# Altium project ECE453-MCU.PrjPcb
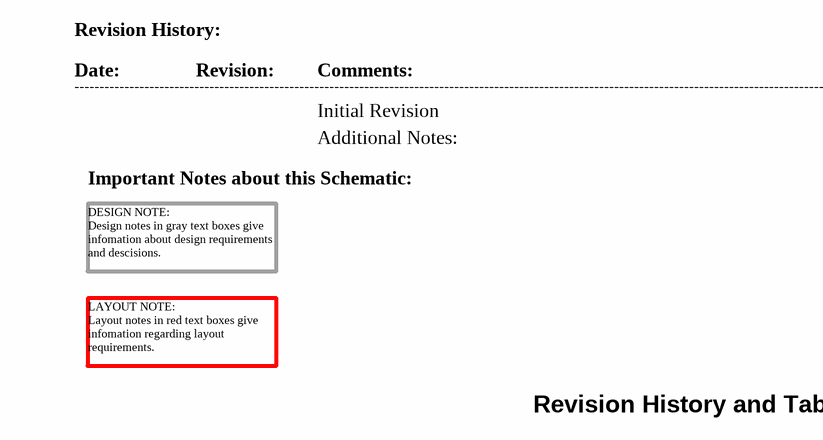
[diagram p0: 01-Revision_History_and_Contents.SchDoc]
9 sheets, 69 parts. Net scope: flat (ports and power ports of the same name join across sheets).
Board file: ECE453.PcbDoc
Sheets:
  01-Revision_History_and_Contents.SchDoc
  02-MCU.SchDoc
  03-Headers.SchDoc
  04-USB.SchDoc
  05-Power_A.SchDoc
  06-Power_B.SchDoc
  07-EEPROM.SchDoc
  Potentiometer.SchDoc
  08-Potentiometer.SchDoc

## Sheet 01-Revision_History_and_Contents.SchDoc: Revision & History
size A; Revision: A; SheetNumber: 1; SheetTotal: 4; ECE315_Project_Name: ECE453 F24 Staff Dev Board

### Notes on the sheet
- Revision History:
- Date:
- ----------------------------------------------------------------------------------------------------------------------------------------------------------------------
- Revision:
- Comments:
- Initial Revision
- Important Notes about this Schematic:
- Additional Notes:
- DESIGN NOTE:
  Design notes in gray text boxes give infomation about design requirements and descisions.
- LAYOUT NOTE:
  Layout notes in red text boxes give infomation regarding layout requirements.
- Revision History and Table of Contents
- Title:
- Size:
- A
- Project
- Rev:
- Sheet:
- of
- College of Engineering
- 1415 Engineering Drive
- Madison, WI 53706

## Sheet 02-MCU.SchDoc
size A
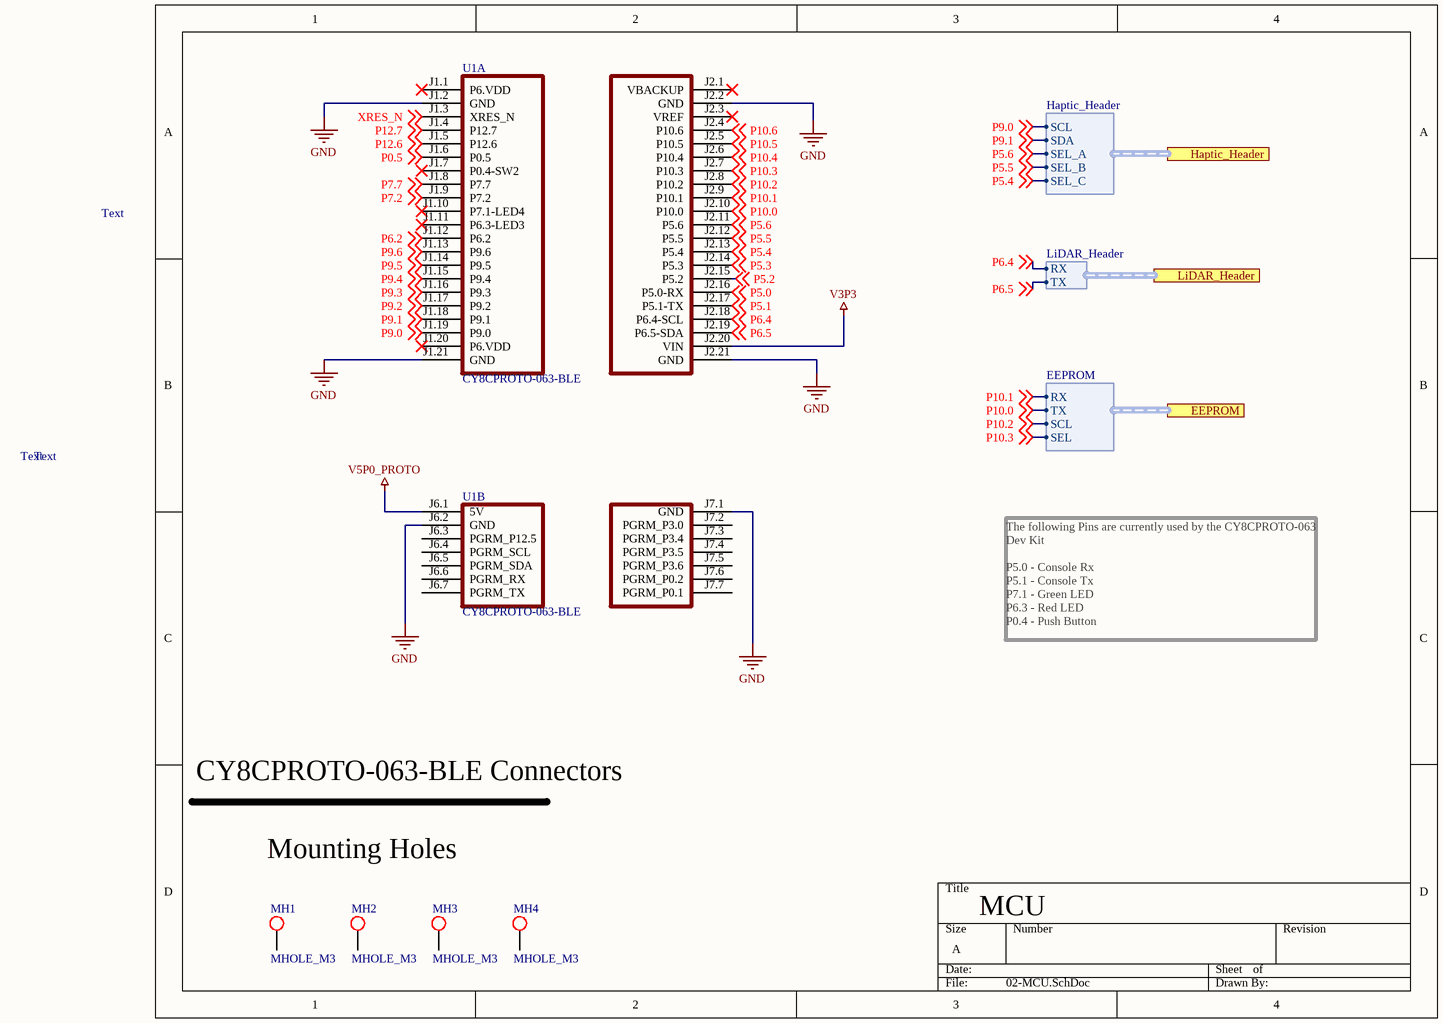
[diagram p1: 02-MCU.SchDoc]

### Parts
MH1  MHOLE_M3  [MHOLE_M3]  (no BOM)
MH2  MHOLE_M3  [MHOLE_M3]  (no BOM)
MH3  MHOLE_M3  [MHOLE_M3]  (no BOM)
MH4  MHOLE_M3  [MHOLE_M3]  (no BOM)
U1  CY8CPROTO-063-BLE  [CY8CPROTO-063-BLE]  (parts A,B of 2)  (no BOM)

### Ports
EEPROM (harness EEPROM), Haptic_Header (harness Haptic_Header), LiDAR_Header (harness LiDAR_Header)

### Harnesses
Haptic_Header: SCL, SDA, SEL_A, SEL_B, SEL_C
LiDAR_Header: RX, TX
EEPROM: RX, TX, SCL, SEL

### Nets
GND: U1.J1.2(GND) U1.J1.21(GND) U1.J2.2(GND) U1.J2.21(GND) U1.J6.2(GND) U1.J7.1(GND)
V3P3: U1.J2.20(VIN)
V5P0_PROTO: U1.J6.1(5V)
P0.5: U1.J1.6(P0.5) ; off-sheet P0.5
P5.0: U1.J2.16(P5.0-RX) ; off-sheet P5.0
P5.1: U1.J2.17(P5.1-TX) ; off-sheet P5.1
P5.2: U1.J2.15(P5.2) ; off-sheet P5.2
P5.3: U1.J2.14(P5.3) ; off-sheet P5.3
P5.4: U1.J2.13(P5.4) ; off-sheet P5.4, port Haptic_Header.SEL_C  [project net HDR_0.SEL_C]
P5.5: U1.J2.12(P5.5) ; off-sheet P5.5, port Haptic_Header.SEL_B  [project net HDR_0.SEL_B]
P5.6: U1.J2.11(P5.6) ; off-sheet P5.6, port Haptic_Header.SEL_A  [project net HDR_0.SEL_A]
P6.2: U1.J1.12(P6.2) ; off-sheet P6.2
P6.4: U1.J2.18(P6.4-SCL) ; off-sheet P6.4, port LiDAR_Header.RX  [project net HDR_1.RX]
P6.5: U1.J2.19(P6.5-SDA) ; off-sheet P6.5, port LiDAR_Header.TX  [project net HDR_1.TX]
P7.2: U1.J1.9(P7.2) ; off-sheet P7.2
P7.7: U1.J1.8(P7.7) ; off-sheet P7.7
P9.0: U1.J1.19(P9.0) ; off-sheet P9.0, port Haptic_Header.SCL  [project net HDR_0.SCL]
P9.1: U1.J1.18(P9.1) ; off-sheet P9.1, port Haptic_Header.SDA  [project net HDR_0.SDA]
P9.2: U1.J1.17(P9.2) ; off-sheet P9.2
P9.3: U1.J1.16(P9.3) ; off-sheet P9.3
P9.4: U1.J1.15(P9.4) ; off-sheet P9.4
P9.5: U1.J1.14(P9.5) ; off-sheet P9.5
P9.6: U1.J1.13(P9.6) ; off-sheet P9.6
P10.0: U1.J2.10(P10.0) ; off-sheet P10.0, port EEPROM.TX  [project net MCU.TX]
P10.1: U1.J2.9(P10.1) ; off-sheet P10.1, port EEPROM.RX  [project net MCU.RX]
P10.2: U1.J2.8(P10.2) ; off-sheet P10.2, port EEPROM.SCL  [project net MCU.SCL]
P10.3: U1.J2.7(P10.3) ; off-sheet P10.3, port EEPROM.SEL  [project net MCU.SEL]
P10.4: U1.J2.6(P10.4) ; off-sheet P10.4
P10.5: U1.J2.5(P10.5) ; off-sheet P10.5
P10.6: U1.J2.4(P10.6) ; off-sheet P10.6
P12.6: U1.J1.5(P12.6) ; off-sheet P12.6
P12.7: U1.J1.4(P12.7) ; off-sheet P12.7
XRES_N: U1.J1.3(XRES_N) ; off-sheet XRES_N

Not connected (* = marked no-connect by the designer): MH1 1; MH2 1; MH3 1; MH4 1; U1 J1.1(P6.VDD)* J1.7(P0.4-SW2)* J1.10(P7.1-LED4)* J1.11(P6.3-LED3)* J1.20(P6.VDD)* J2.1(VBACKUP)* J2.3(VREF)* J6.3(PGRM_P12.5) J6.4(PGRM_SCL) J6.5(PGRM_SDA) J6.6(PGRM_RX) J6.7(PGRM_TX) J7.2(PGRM_P3.0) J7.3(PGRM_P3.4) J7.4(PGRM_P3.5) J7.5(PGRM_P3.6) J7.6(PGRM_P0.2) J7.7(PGRM_P0.1)

### Notes on the sheet
- Text
- The following Pins are currently used by the CY8CPROTO-063 Dev Kit
  P5.0 - Console Rx
  P5.1 - Console Tx
  P7.1 - Green LED
  P6.3 - Red LED
  P0.4 - Push Button
- CY8CPROTO-063-BLE Connectors
- Mounting Holes
- MCU

### Library data of the parts
MH1-MH4 = MHOLE_M3: Mounting Hole - M3 Metric
U1 = IC_CY8CPROTO-063-BLE

## Sheet 03-Headers.SchDoc
size A
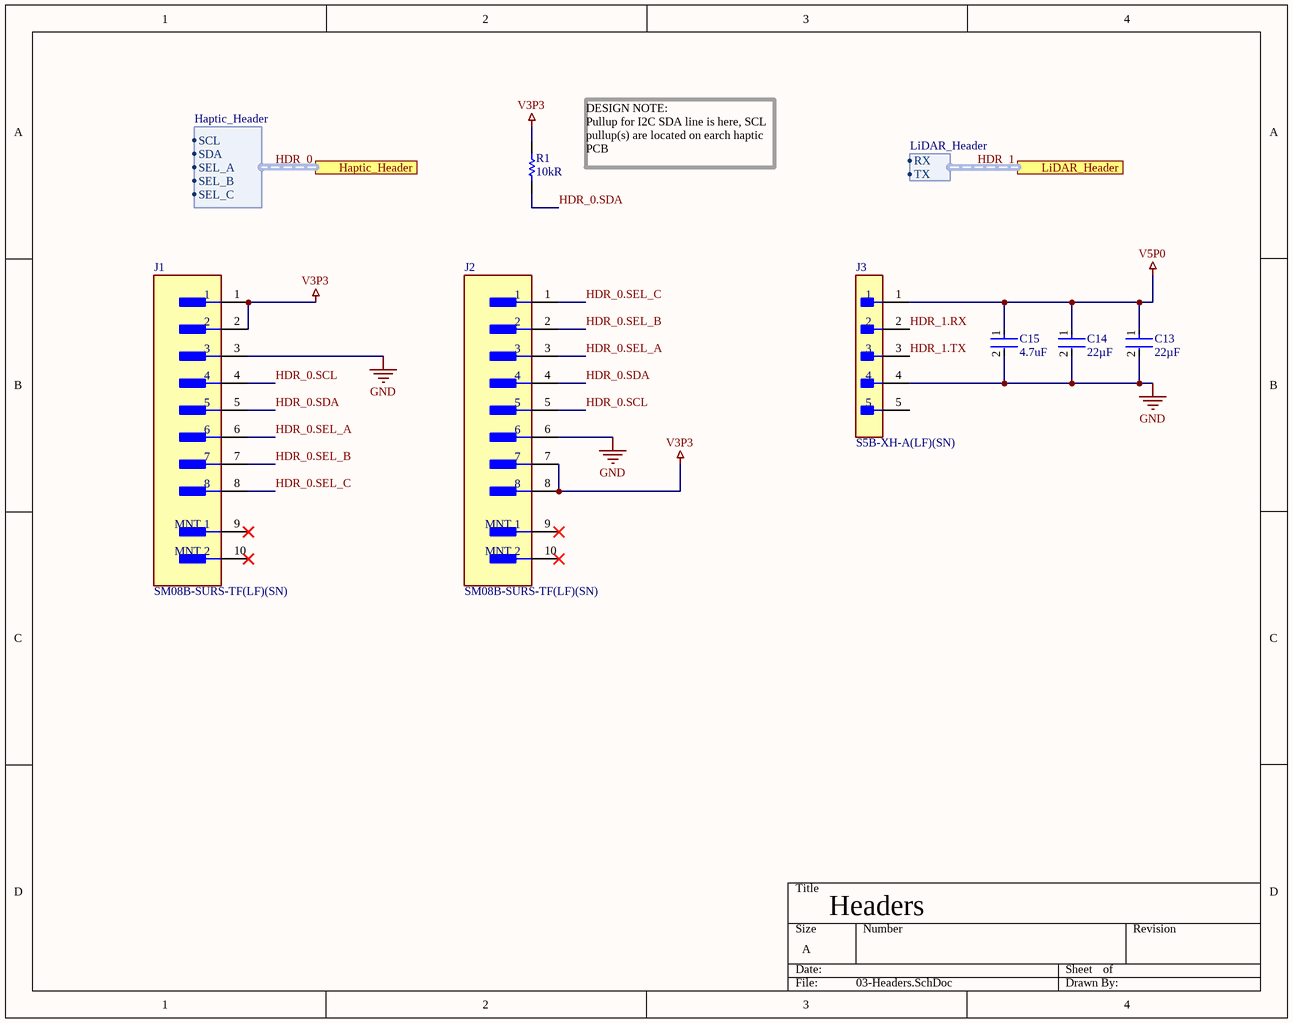
[diagram p2: 03-Headers.SchDoc]

### Parts
C13  22µF  [FP-GRM21B-0_2-e0_2_0_7-IPC_B]
C14  22µF  [FP-GRM21B-0_2-e0_2_0_7-IPC_B]
C15  4.7uF  [FP-CC0805-0_85-MFG]
J1  SM08B-SURS-TF(LF)(SN)  [FP-SM08B-SURS-TF_LF_SN-MFG]
J2  SM08B-SURS-TF(LF)(SN)  [FP-SM08B-SURS-TF_LF_SN-MFG]
J3  S5B-XH-A(LF)(SN)  [FP-S5B-XH-A_LF_SN-MFG]
R1  Resistance: 10kR  [RESC2013X60X35NL10T20]  (hidden comment: RC0805FR-0710KL)

### Ports
Haptic_Header (harness Haptic_Header), LiDAR_Header (harness LiDAR_Header)

### Harnesses
Haptic_Header: SCL, SDA, SEL_A, SEL_B, SEL_C
LiDAR_Header: RX, TX

### Nets
GND: C13.2 C14.2 C15.2 J1.3 J2.6 J3.4
V3P3: J1.1 J1.2 J2.7 J2.8 R1.1
V5P0: C13.1 C14.1 C15.1 J3.1
HDR_0.SCL: J1.4 J2.5
HDR_0.SDA: J1.5 J2.4 R1.2
HDR_0.SEL_A: J1.6 J2.3
HDR_0.SEL_B: J1.7 J2.2
HDR_0.SEL_C: J1.8 J2.1
HDR_1.RX: J3.2
HDR_1.TX: J3.3

Not connected (* = marked no-connect by the designer): J1 9(MNT_1)* 10(MNT_2)*; J2 9(MNT_1)* 10(MNT_2)*; J3 5

### Buses and harness runs
harness HDR_0 = port Haptic_Header
harness HDR_1 = port LiDAR_Header

### Notes on the sheet
- DESIGN NOTE:
  Pullup for I2C SDA line is here, SCL pullup(s) are located on earch haptic PCB
- Headers

### Library data of the parts
C13 C14 = CMP-06035-023072-1: Chip Multilayer Ceramic Capacitors for General Purpose, 0805, 22uF, X7R, 15%, 20%, 10V
C15 = CMP-03422-001026-1: CC0805MKX7R8BB475 / CAP CER 4.7UF 25V X7R 0805; Manufacturer: Yageo; Material: Ceramic; Tolerance: 0.2; Ipc Land Pattern Name: CAPC200125X85; ComponentLink2Description: Datasheet; ComponentLink2URL: http://www.yageo.com/documents/recent/UPY-GPHC_Y5V_6.3V-to-50V_8.pdf; Lead Free: Yes; Mouser Description: Cap Cer 4.7UF 25V X7R 0805; Temperature: -30°C to +85°C; Device Class L3: Ceramic Capacitors; RoHS: TRUE; Height: 0.95mm; Temperature Range Low: -30°C; Device Class L2: Capacitors; Voltage Rating: 25 V; Temperature Characteristic: X7R; Value: 4.7 uF; Category: Cap; Digikey Description: CAP CER 4.7UF 25V X7R 0805; Package: CC0805-0.85; Footprint Url: http://www.yageo.com/exep/pages/download/literatures/UPY-C_GEN_24.pdf; Capacitance: 4.7 uF; Temperature Range High: +85°C; Manufacturer Part Number: CC0805MKX7R8BB475; Device Class L1: Passive Components; Octopart: https://octopart.com/cc0805mkx7r8bb475-yageo-81932647; Automotive: No
J1 J2 = CMP-17439-000103-1: CONN HEADER SMD R/A 8POS 0.8MM; Voltage Rating: 30V; Number of Poles: 8; Current Rating: 500mA; Gender: Male; Wire/Cable Gauge: 32AWG; Insulation Resistance: 100MR; Body Plating: Tin; Color: Natural; Mount: Surface Mount; Series: SUR; Packaging: Cut Tape; Number of Rows: 1; REACH SVHC: No SVHC; Lead Pitch: 0.8mm; Insulation Color: Natural; Contact Type: Outer Shroud Contact; Lead Free: Lead Free; Contact Plating: Tin; Working Voltage: 30V; Contact Shape: Rectangular; Min Operating Temperature: -25°C; Number of Positions: 8; Number of Contacts: 8; Pitch: 0.8mm; Fastening Type: Pull; Max Operating Temperature: 85°C; Material: Polyamide; Insulation Material: Nylon; Connector Type: Header; Termination: IDC; Contact Finish - Mating: TIN; Flammability Rating: UL94 V-0; Contact Material: Copper Alloy
J3 = CMP-17439-000302-1: CONN HEADER R/A 5POS 2.5MM; Contact Resistance: 10mR; Voltage Rating: 250V; Number of Contacts: 5; Current Rating: 3A; Insulation Resistance: 1GR; Wire/Cable Gauge: 22AWG; Number of Rows: 1; Contact Plating: Tin; Fastening Type: Detent; Contact Finish - Mating: TIN; Contact Material: Brass; Lead Free: Lead Free; Connector Type: Header; REACH SVHC: No SVHC; Insulation Color: Natural; Orientation: Right Angle; Contact Type: Male Pin; Pitch: 2.5mm; Contact Shape: Square; Series: XH; Color: Natural; Lead Pitch: 2.5mm; Mount: Through Hole; Termination: Solder; Max Operating Temperature: 85°C; Number of Positions: 5; Flammability Rating: UL94 V-0; Min Operating Temperature: -25°C; Packaging: Bulk; Voltage Rating (AC): 250V; Insulation Material: Nylon
R1 = CMP-1659-00013-4: DRV2605 I2C SDA pullup resistor / Chip Resistor, 10 KOhm, +/- 1%, 0.125 W, -55 to 155 degC, 0805 (2012 Metric), RoHS, Tape and Reel; Manufacturer: Yageo; Voltage Rating: 150 V; Power Rating: 125mW; Temperature Coefficient: 100ppm/°C; Mount: Surface Mount; ComponentLink1Description: Manufacturer URL; ComponentLink2URL: http://www.yageo.com/documents/recent/PYu-RC_Group_51_RoHS_L_04.pdf; Pins: 2; Length: 2 mm; Min Operating Temperature: -55 degC; Height: 0.5 mm; Mounting Technology: Surface Mount; RoHSCompliant: true; REACH SVHC: No SVHC; ComponentLink1URL: http://www.yageo.com/; Max Operating Temperature: 155 degC; PackageReference: 0805; DatasheetVersion: Rev. 4, 02/2016; Package Quantity: 5000; Packaging: Tape and Reel; ComponentLink2Description: Datasheet; PackageDescription: 2-Pin Surface Mounted Device, Body 2 x 1.25 mm; Supplier 1: Digi-Key; Supplier Part Number 1: 311-10.0KCRCT-ND; Manufacturer 1: Yageo; Manufacturer Part Number 1: RC0805FR-0710KL; RoHS: Yes; Category: Chip SMD Resistors; Stock 1: 12202331; Pricing 1: 1=0.10000, 10=0.03700, 100=0.01520, 1000=0.00682, 2500=0.00592 (USD); Case/Package: 0805; Case Code (Imperial): 0805; Case Code (Metric): 2012; Size Code: 0805; Tolerance: 1%; Termination: SMD/SMT; Series: RC; Max Power Dissipation: 125mW; Resistance Tolerance: 1%; Resistor Type: Thick Film; Number of Terminations: 2; Features: Moisture Resistant; Construction: Rectangular; Technology: THICK FILM; Width: 0.049inch; Depth: 1.25mm; RoHS Compliant: Yes; Lead Free: Lead Free; Military Standard: Not

## Sheet 04-USB.SchDoc
size A
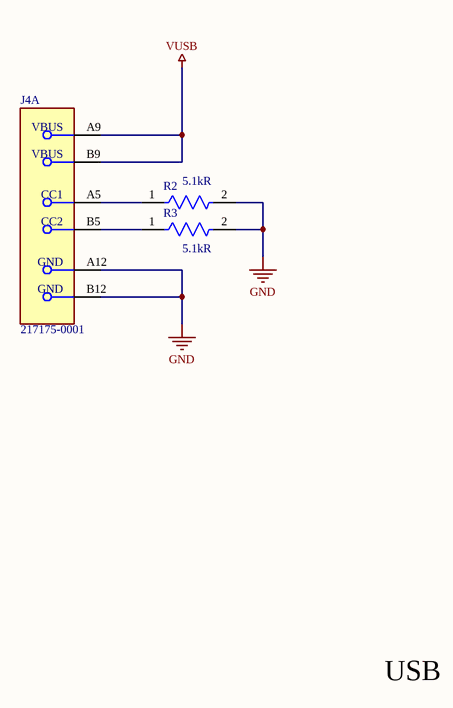
[diagram p3: 04-USB.SchDoc]

### Parts
J4  217175-0001  [FP-217175-0001-MFG]  (part A of 2)
R2  5.1kR  [FP-RN73R2A-IPC_C]
R3  5.1kR  [FP-RN73R2A-IPC_C]

### Nets
GND: J4.A12(GND) J4.B12(GND) R2.2 R3.2
VUSB: J4.A9(VBUS) J4.B9(VBUS)
NetJ4_A5: J4.A5(CC1) R2.1
NetJ4_B5: J4.B5(CC2) R3.1

### Notes on the sheet
- USB

### Library data of the parts
J4 = CMP-04767-000026-1: CONN RCP USB2.0 C 6+18P SMD RA
R2 R3 = CMP-04015-014497-1: 5.1kΩ ±0.05% 0.125W, 1/8W Chip Resistor 0805 (2012 Metric) Moisture Resistant Thin Film

## Sheet 05-Power_A.SchDoc
size A
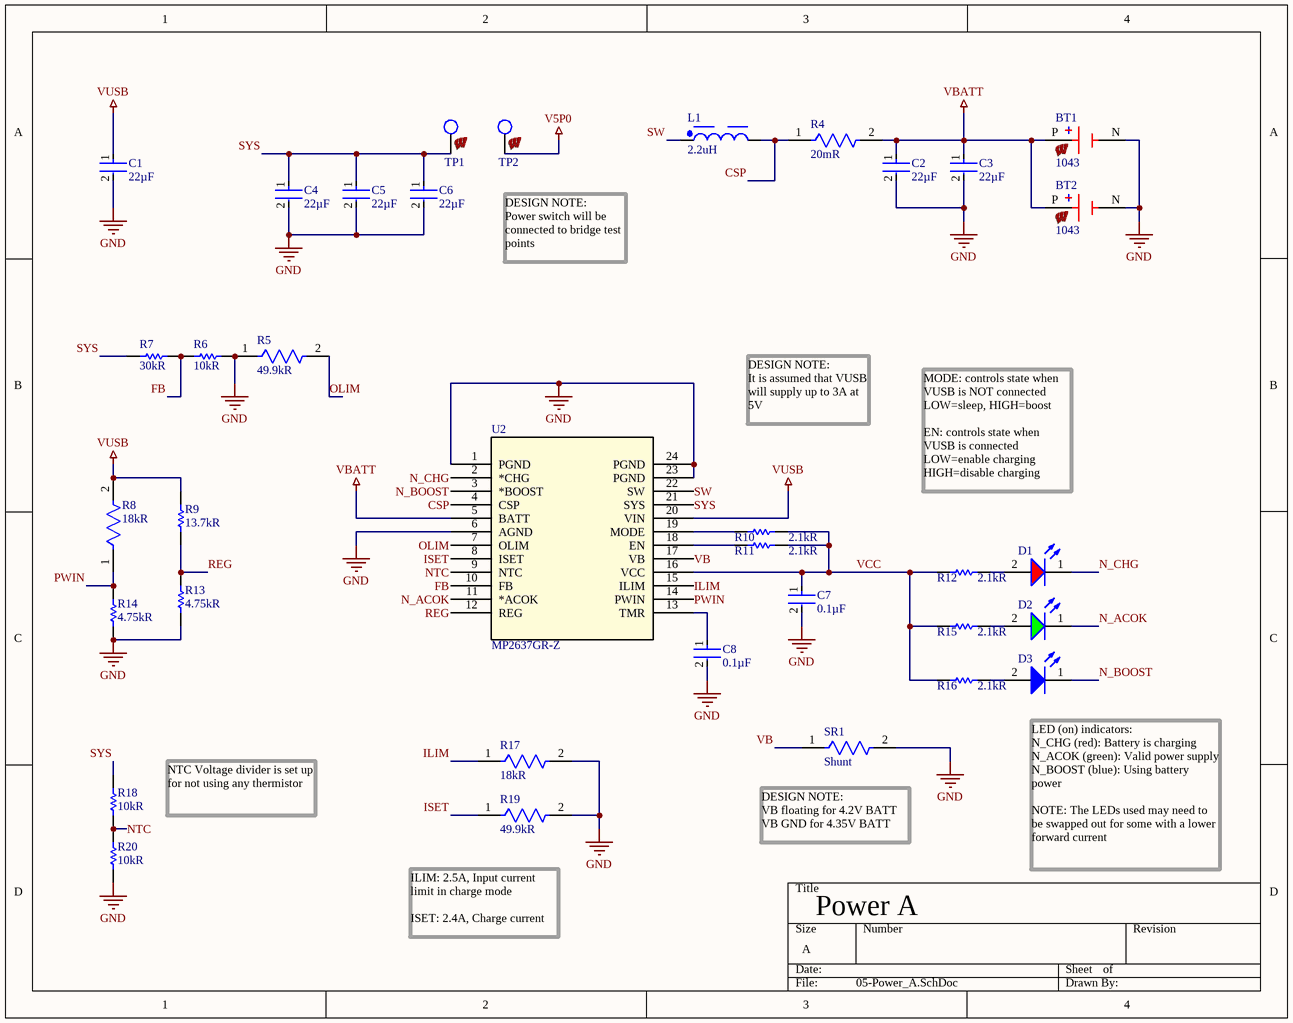
[diagram p4: 05-Power_A.SchDoc]

### Parts
BT1  1043  [BAT_1043]
BT2  1043  [BAT_1043]
C1  22µF  [FP-GRM21B-0_2-e0_2_0_7-IPC_B]
C2  22µF  [FP-GRM21B-0_2-e0_2_0_7-IPC_B]
C3  22µF  [FP-GRM21B-0_2-e0_2_0_7-IPC_B]
C4  22µF  [FP-GRM21B-0_2-e0_2_0_7-IPC_B]
C5  22µF  [FP-GRM21B-0_2-e0_2_0_7-IPC_B]
C6  22µF  [FP-GRM21B-0_2-e0_2_0_7-IPC_B]
C7  0.1µF  [FP-C0805C-DN-MFG]
C8  0.1µF  [FP-C0805C-DN-MFG]
D1  150080RS75000  [WL-SMCW_0805_150080xx75000]  (value not drawn)
D2  150080GS75000  [WL-SMCW_0805_150080xx75000]  (value not drawn)
D3  150080BS75000  [WL-SMCW_0805_150080xx75000]  (value not drawn)
L1  2.2uH  [WE-TPC_8043]
R4  20mR  [FP-CSR0805-MFG]
R5  49.9kR  [FP-RMCF0805-IPC_A]
R6  10kR  [RESC2013X70X40ML20T20]
R7  30kR  [RESC2013X70X40LL20T20]
R8  18kR  [FP-CRGP0805-IPC_C]
R9  13.7kR  [RESC2013X70X40ML20T20]
R10  2.1kR  [RESC2013X70X40ML20T20]
R11  2.1kR  [RESC2013X70X40ML20T20]
R12  2.1kR  [RESC2013X70X40ML20T20]
R13  4.75kR  [RESC2013X50X30LL20T20]
R14  4.75kR  [RESC2013X50X30LL20T20]
R15  2.1kR  [RESC2013X70X40ML20T20]
R16  2.1kR  [RESC2013X70X40ML20T20]
R17  18kR  [FP-CRGP0805-IPC_C]
R18  10kR  [RESC2013X70X40ML20T20]
R19  49.9kR  [FP-RMCF0805-IPC_A]
R20  10kR  [RESC2013X70X40ML20T20]
SR1  Shunt  [FP-CSSH0805FT1L00-MFG]
TP1  TP  [TP_UW]  (value not drawn)  (no BOM)
TP2  TP  [TP_UW]  (value not drawn)  (no BOM)
U2  MP2637GR-Z  [QFN-24_MP2637_MNP]

### Nets
GND: BT1.N(NEG) BT2.N(NEG) C1.2 C2.2 C3.2 C4.2 C5.2 C6.2 C7.2 C8.2 R5.1 R6.2 R13.1 R14.1 R17.2 R19.2 R20.1 SR1.2 U2.1(PGND) U2.6(AGND) U2.23(PGND) U2.24(PGND)
V5P0: TP2.1
VBATT: BT1.P(POS) BT2.P(POS) C2.1 C3.1 R4.2 U2.5(BATT)
VUSB: C1.1 R8.2 R9.2 U2.20(VIN)
CSP: L1.2 R4.1 U2.4(CSP)
FB: R6.1 R7.2 U2.10(FB)
ILIM: R17.1 U2.15(ILIM)
ISET: R19.1 U2.8(ISET)
N_ACOK: D2.1(K) U2.11(*ACOK)
N_BOOST: D3.1(K) U2.3(*BOOST)
N_CHG: D1.1(K) U2.2(*CHG)
NTC: R18.1 R20.2 U2.9(NTC)
OLIM: R5.2 U2.7(OLIM)
PWIN: R8.1 R14.2 U2.14(PWIN)
REG: R9.1 R13.2 U2.12(REG)
SW: L1.1 U2.22(SW)
SYS: C4.1 C5.1 C6.1 R7.1 R18.2 TP1.1 U2.21(SYS)
VB: SR1.1 U2.17(VB)
VCC: C7.1 R10.2 R11.2 R12.1 R15.1 R16.1 U2.16(VCC)
NetC8_1: C8.1 U2.13(TMR)
NetD1_2: D1.2(A) R12.2
NetD2_2: D2.2(A) R15.2
NetD3_2: D3.2(A) R16.2
NetR10_1: R10.1 U2.19(MODE)
NetR11_1: R11.1 U2.18(EN)

### Notes on the sheet
- DESIGN NOTE:
  Power switch will be connected to bridge test points
- DESIGN NOTE:
  It is assumed that VUSB will supply up to 3A at 5V
- MODE: controls state when VUSB is NOT connected
  LOW=sleep, HIGH=boost
  EN: controls state when VUSB is connected
  LOW=enable charging
  HIGH=disable charging
- NTC Voltage divider is set up for not using any thermistor
- (near SR1) DESIGN NOTE:
  VB floating for 4.2V BATT
  VB GND for 4.35V BATT
- (near D3) LED (on) indicators:
  N_CHG (red): Battery is charging
  N_ACOK (green): Valid power supply
  N_BOOST (blue): Using battery power
  NOTE: The LEDs used may need to be swapped out for some with a lower forward current
- ILIM: 2.5A, Input current limit in charge mode
  ISET: 2.4A, Charge current
- Power A

### Library data of the parts
BT1 BT2 = 1043: Manufacturer: Keystone Electronics; Price: None; Availability: Unavailable; Value: *; MP: 1043; Package: None; Supplier: Digikey; Supplier Part Number: 36-1043-ND; Manufacturer Part Number: 1043; RoHS: Yes; Category: Batteries and Accessories; Stock: 4625; Pricing: 1=3.38, 25=2.604, 100=2.328, 250=2.16176, 500=2.04398, 1000=1.9326, 2500=1.79464, 5000=1.69686 (USD); ComponentLink1URL: https://datasheet.ciiva.com/4/1043-4710.pdf?src-supplier=Digikey; ComponentLink1Description: https://datasheet.ciiva.com/4/1043-4710.pdf?src-supplier=Digikey; ComponentLink2URL: https://datasheet.ciiva.com/3353/1043-eng-tds-3353208.pdf?src-supplier=Distrelec; ComponentLink2Description: https://datasheet.ciiva.com/3353/1043-eng-tds-3353208.pdf?src-supplier=Distrelec; ComponentLink3URL: https://datasheet.ciiva.com/41803/1043-41803215.pdf?src-supplier=Digikey; ComponentLink3Description: https://datasheet.ciiva.com/41803/1043-41803215.pdf?src-supplier=Digikey; ComponentLink4URL: https://datasheet.ciiva.com/4642/1043-4642493.pdf?src-supplier=Mouser; ComponentLink4Description: https://datasheet.ciiva.com/4642/1043-4642493.pdf?src-supplier=Mouser
C1-C6 = CMP-06035-023072-1: as C13 on sheet 03-Headers
C7 C8 = CMP-2007-00279-2: CAP CER 0.1UF 50V X7R 0805; Manufacturer Part Number: C0805C104K5RACTU; Manufacturer: KEMET; Value: 0.10 μF; Tolerance: 0.1; Temperature Coefficient: 30ppm/°C; Material: Ceramic; Device Class L2: Capacitors; Temperature Range Low: -55°C; Voltage Rating: 50 V; Digikey Description: CAP CER 0.1UF 50V X7R 0805; Category: Cap; ComponentLink2Description: Datasheet; Octopart: https://octopart.com/c0805c104k5ractu-kemet-143926; RoHS: TRUE; ComponentLink2URL: https://content.kemet.com/datasheets/KEM_C1003_C0G_SMD.pdf; Temperature Characteristic: X7R; Temperature: -55°C to +125°C; Height: 0.88mm; Temperature Range High: +125°C; Device Class L1: Passive Components; Automotive: No; Lead Free: Yes; Ipc Land Pattern Name: CAPC200125X78; Device Class L3: Ceramic Capacitors; Mouser Description: Cap Ceramic 0.1uF 50V X7R 10% SMD 2.0 x 1.2 mm 125 C Paper T/R; Capacitance: 0.10 μF; Package: C0805C-DN
D1 = CMP-1426-00011-3: 150080RS75000 / LED Uni-Color Red 630nm 2-Pin Chip 0805(2012Metric) T/R; Viewing Angle: 140°; Max Junction Temperature (Tj): 95°C; Power Dissipation: 72mW; Forward Current: 100mA; Forward Voltage: 2V; Wavelength: 625nm; Test Current: 20mA; Max Reverse Voltage (DC): 5V; Luminous Intensity: 150mcd; Lens Style: Clear, Rectangular; REACH SVHC: Unknown; Height: 700µm; Case Code (Metric): 2012; Peak Wavelength: 630nm; Length: 2mm; Width: 1.25mm; RoHS: Compliant; Packaging: Tape and Reel; Dominant Wavelength: 625nm; Color: Red; Case Code (Imperial): 0805; Min Operating Temperature: -40°C; Mount: Surface Mount; Max Operating Temperature: 85°C; Case/Package: 0805
D2 = CMP-1426-00007-3: WURTH ELEKTRONIK - 150080GS75000 - LED, Green, SMD, 0805, 30 mA, 3.2 V, 520 nm; Forward Voltage: 3.2V; Viewing Angle: 140°; Power Dissipation: 105mW; Peak Wavelength: 515nm; Max Reverse Voltage (DC): 5V; Luminous Intensity: 450mcd; Wavelength: 525nm; Max Junction Temperature (Tj): 95°C; Forward Current: 100mA; Test Current: 20mA; Lens Style: Clear, Rectangular; Length: 2mm; Case/Package: 0805; Case Code (Metric): 2012; Color: Green; Height: 700µm; Width: 1.25mm; Packaging: Tape and Reel; Mount: Surface Mount; REACH SVHC: Unknown; RoHS: Compliant; Min Operating Temperature: -40°C; Reverse Voltage: 5V; Max Operating Temperature: 85°C; Dominant Wavelength: 525nm; Case Code (Imperial): 0805
D3 = CMP-1426-00008-7: Led, Blue, 470 Nm, 3.2 V, 30 Ma, 145 Mcd Rohs Compliant: Yes; Dominant Wavelength: 470nm; Max Junction Temperature (Tj): 95°C; Power Dissipation: 105mW; Peak Wavelength: 465nm; Max Reverse Voltage (DC): 5V; Forward Current: 100mA; Test Current: 20mA; Luminous Intensity: 145mcd; Lens Style: Clear, Rectangular; Viewing Angle: 140°; Forward Voltage: 3.2V; Color: Blue; Height: 700µm; Case Code (Imperial): 0805; Width: 1.25mm; REACH SVHC: Unknown; Case/Package: 0805; Lead Free: Lead Free; Mount: Surface Mount; Packaging: Tape and Reel; RoHS: Compliant; Reverse Voltage: 5V; Min Operating Temperature: -40°C; Case Code (Metric): 2012; Wavelength: 470nm; Max Operating Temperature: 85°C; Length: 2mm
L1 = CMP-1479-00021-3: Fixed Ind 2.2UH 5.4A 13 Mohm SMD; NexarPartId: 23392435; Inductance Tolerance: 30%; Self Resonant Frequency: 62MHz; Inductance: 2.2µH; DC Resistance (DCR): 10mΩ; Shielding: Shielded; Series Resistance: 13mΩ; Test Frequency: 100kHz; Saturation Current: 6.3A; Core Material: Ferrite; Packaging: Cut Tape (CT); Width: 8mm; Current Rating: 5.4A; Max Operating Temperature: 125°C; Tolerance: 30%; Number of Pins: 2; Mount: Surface Mount; Termination: SMD/SMT; Min Operating Temperature: -40°C; Lead Free: Lead Free; Ambient Temperature Range High: 85°C; RMS Current (Irms): 5.4A; RoHS: Compliant; Case/Package: Nonstandard; Height: 4.3mm; Composition: Wirewound; REACH SVHC: Unknown; Ambient Temperature Range Low: -40°C; Height - Seated (Max): 4.5974mm; Max DC Current: 5.4A; Length: 8mm
R4 = CMP-26527-003859-1: General Purpose Thick Film Chip Resistor, 0805, 20mΩ, 1%, 200ppm/°C, 0.25W; Max Power Dissipation: 250mW; Case Code (Metric): 2012; Temperature Coefficient: 200ppm/°C; Number of Terminations: 2; Tolerance: 1%; Series: CSR; Length: 0.079inch; Max Operating Temperature: 155°C; Resistance: 20mR; RoHS Compliant: Yes; Case Code (Imperial): 0805; Contact Plating: Tin; Height: 0.026inch; Case/Package: 0805; Lead Free: Lead Free; Mount: Surface Mount; Min Operating Temperature: -55°C; Packaging: Tape and Reel; Width: 0.049inch; Radiation Hardening: No; Resistor Type: Thick Film
R5 R19 = CMP-26527-000576-1: 49.9kΩ ±1% 0.125W 0805 Thick Film Chip Resistor AEC-Q200 compliant; Max Power Dissipation: 125mW; Temperature Coefficient: 100ppm/°C; Lead Free: Lead Free; RoHS Compliant: Yes; Contact Plating: Tin; Construction: Rectangular; Width: 0.049inch; Number of Terminations: 2; Series: RMCF; Depth: 1.25mm; Min Operating Temperature: -55°C; Package Quantity: 1; Case Code (Imperial): 0805; Max Operating Temperature: 155°C; Radiation Hardening: No; Military Standard: Not; Resistor Type: Thick Film; Tolerance: 1%; Features: Automotive AEC-Q200; Size Code: 0805; Case Code (Metric): 2012; Height: 0.026inch; Case/Package: 0805; Mount: Surface Mount; Length: 2mm; Power Rating: 125mW; Resistance: 49.9kR; Packaging: Tape and Reel
R6 R18 R20 = CMP-2001-04376-1: Manufacturer: Panasonic; Part Number: ERJ-6ENF1002V
R7 = CMP-1013-00675-4: RES 30.0K OHM 1/8W 1% 0805 SMD; Manufacturer: Panasonic; PartNumber: ERJ-6ENF3002V; ComponentLink1URL: http://industrial.panasonic.com/cdbs/www-data/pdf/RDA0000/AOA0000C86.pdf; ComponentLink1Description: Datasheet; PackageReference: 0805
R8 R17 = CMP-03211-002159-1: CRGP0805 18KΩ 0.33W ±100ppm/°C 1% 150V; Manufacturer Part Number: CRGP0805F18K; Manufacturer: TE; Tolerance: 0.01; Device Class L3: Chip SMD Resistors; Value: 18KΩ; ComponentLink2Description: Datasheet; Temperature Range Low: -55°C; Lead Free: Yes; Temperature Coefficient: ±100ppm/°C; Resistance: 18KΩ; Series: CRGP; Temperature: -55°C to +155°C; Ambient Temperature Range High: +70°C; Package: CRGP0805; RoHS: TRUE; Octopart: https://octopart.com/crgp0805f18k-te+connectivity-91018794; Automotive: No; Device Class L2: Resistors; Voltage Rating: 150V; ComponentLink2URL: https://www.mouser.com/datasheet/2/418/NG_DS_9-1773463-9_A-1358566.pdf; Power Rating: 0.33W; Composition: Thick Film; Device Class L1: Passive Components; Category: Res; Ipc Land Pattern Name: RESC200125X55; Height: 0.65mm; Temperature Range High: +155°C
R9 = CMP-2001-04425-1: ERJ-6ENF1372V; Manufacturer: Panasonic; Part Number: ERJ-6ENF1372V
R10-R12 R15 R16 = CMP-2001-00036-1: Res Thick Film 0805 2.1K Ohm 1% 0.125W(1/8W) ±100ppm/C Pad SMD T/R Automotive AEC-Q200; Part Number: ERJ-6ENF2101V; Manufacturer: Panasonic
R13 R14 = CMP-2001-03970-1: CRCW08054K75FKTA; Manufacturer: Vishay Dale; Part Number: CRCW08054K75FKTA
SR1 = CMP-26527-002759-1: CSSH0805FT1L00 / RES SHUNT, 0805, 0.001 OHM, 1%,; RoHS Compliant: Yes
TP1 = TP: Power switch source terminal. / Debugging Test Point 0.3/0.6mm
TP2 = TP: Power switch output terminal. / Debugging Test Point 0.3/0.6mm
U2 = MP2637GR-Z: 2.5A Single Cell Switch Mode Battery Charger with Power Path Management (PPM) and 2.4A Boost Current with Trickle Timer; Manufacturer_Name: Monolithic Power Systems; Copyright: Copyright (C) 2025 Ultra Librarian. All rights reserved.; Manufacturer_Part_Number: MP2637GR-Z; Datasheet: https://www.monolithicpower.com/en/documentview/productdocument/index/version/2/document_type/Datasheet/lang/en/sku/MP2637GR-Z; RefDes: RefDes; Type: Type

## Sheet 06-Power_B.SchDoc
size A
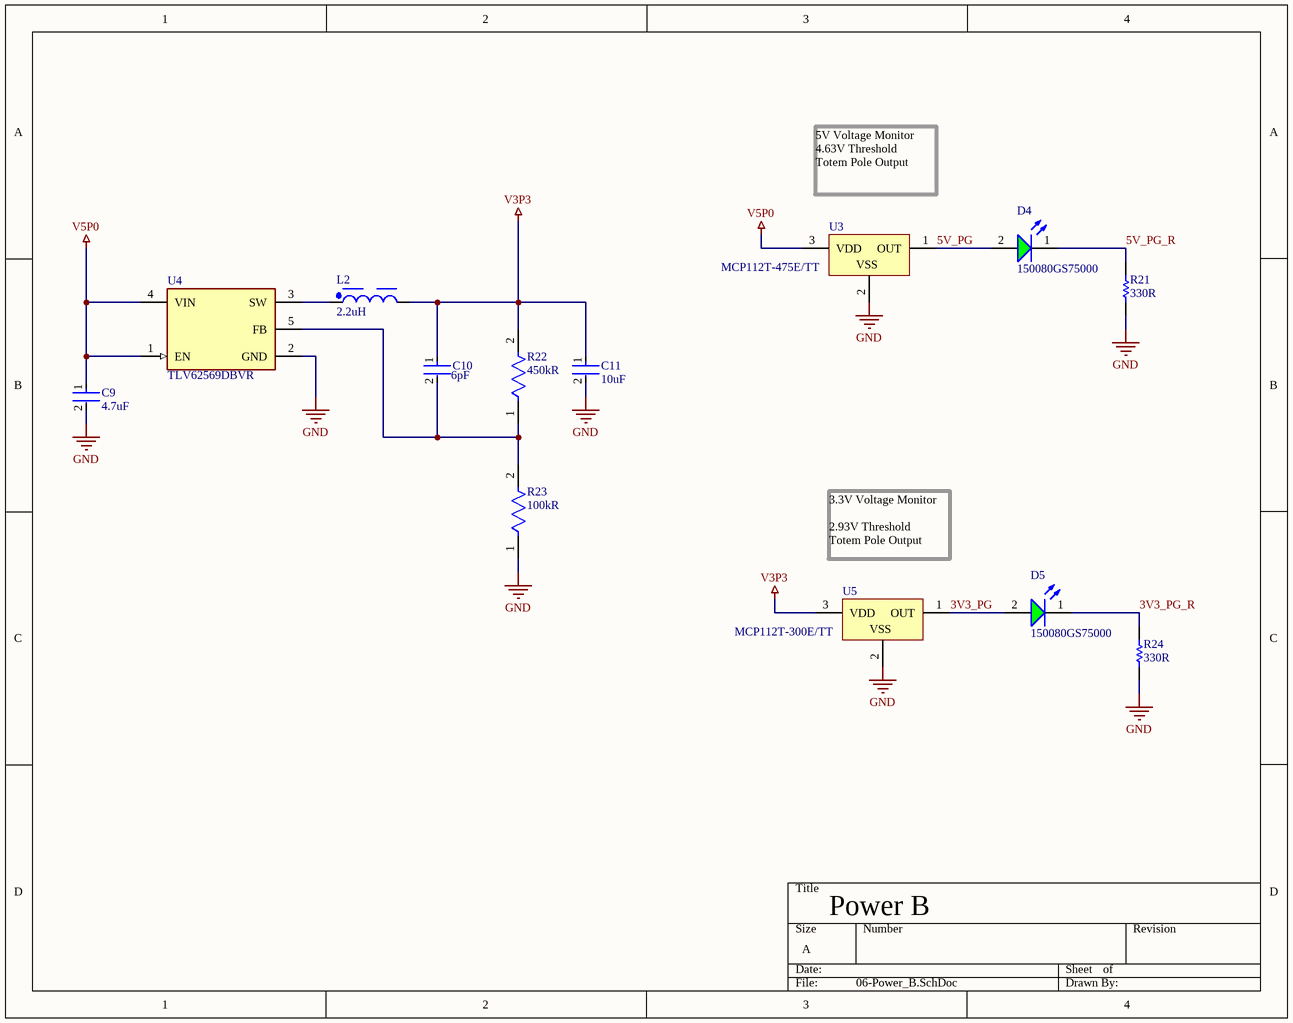
[diagram p5: 06-Power_B.SchDoc]

### Parts
C9  4.7uF  [FP-CC0805-0_85-MFG]
C10  6pF  [FP-CBR08C-MFG]
C11  10uF  [FP-C0805C-DG-MFG]
D4  150080GS75000  [WL-SMCW_0805_150080xx75000]
D5  150080GS75000  [WL-SMCW_0805_150080xx75000]
L2  2.2uH  [WE-TPC_8043]
R21  value 330R  [RESC2013X60X40LL20T25]  (hidden comment: ERA6AEB331V)
R22  450kR  [FP-RT0805-MFG]
R23  100kR  [FP-RMCF0805-IPC_C]
R24  value 330R  [RESC2013X60X40LL20T25]  (hidden comment: ERA6AEB331V)
U3  MCP112T-475E/TT  [SOT-23-TT3_L]
U4  TLV62569DBVR  [FP-DBV0005A-MFG]
U5  MCP112T-300E/TT  [SOT-23-TT3_L]

### Nets
GND: C9.2 C11.2 R21.1 R23.1 R24.1 U3.2(VSS) U4.2(GND) U5.2(VSS)
V3P3: C10.1 C11.1 L2.2 R22.2 U5.3(VDD)
V5P0: C9.1 U3.3(VDD) U4.1(EN) U4.4(VIN)
3V3_PG: D5.2(A) U5.1(OUT)
3V3_PG_R: D5.1(K) R24.2
5V_PG: D4.2(A) U3.1(OUT)
5V_PG_R: D4.1(K) R21.2
NetC10_2: C10.2 R22.1 R23.2 U4.5(FB)
NetL2_1: L2.1 U4.3(SW)

### Notes on the sheet
- 5V Voltage Monitor
  4.63V Threshold
  Totem Pole Output
- 3.3V Voltage Monitor
  2.93V Threshold
  Totem Pole Output
- Power B

### Library data of the parts
C9 = CMP-03422-001026-1: as C15 on sheet 03-Headers; Ipc Land Pattern Name: CAPC200125X85; ComponentLink2Description: Datasheet; ComponentLink2URL: http://www.yageo.com/documents/recent/UPY-GPHC_Y5V_6.3V-to-50V_8.pdf; Lead Free: Yes; Mouser Description: Cap Cer 4.7UF 25V X7R 0805; Temperature: -30°C to +85°C; Device Class L3: Ceramic Capacitors; RoHS: TRUE; Height: 0.95mm; Temperature Range Low: -30°C; Device Class L2: Capacitors; Voltage Rating: 25 V; Temperature Characteristic: X7R; Value: 4.7 uF; Category: Cap; Digikey Description: CAP CER 4.7UF 25V X7R 0805; Package: CC0805-0.85; Footprint Url: http://www.yageo.com/exep/pages/download/literatures/UPY-C_GEN_24.pdf; Capacitance: 4.7 uF; Temperature Range High: +85°C; Manufacturer Part Number: CC0805MKX7R8BB475; Device Class L1: Passive Components; Octopart: https://octopart.com/cc0805mkx7r8bb475-yageo-81932647; Automotive: No
C10 = CMP-03020-018446-1: CAP CER 6PF 250V C0G/NP0 0805; Manufacturer Part Number: CBR08C609CAGAC; Manufacturer: KEMET; Temperature Characteristic: C0G; Tolerance: 0.25 pF; Material: Ceramic; Temperature Coefficient: 30ppm/°C; Capacitance: 6.0 pF; Value: 6.0 pF; Lead Free: Yes; Category: Cap; Device Class L3: Ceramic Capacitors; Temperature: -55°C to +125°C; Height: 0.95mm; Package: CBR08C; Temperature Range Low: -55°C; Device Class L1: Passive Components; ComponentLink2Description: Datasheet; ComponentLink2URL: https://content.kemet.com/datasheets/KEM_C1030_CBR_SMD.pdf; Digikey Description: CAP CER 6PF 250V C0G/NP0 0805; Ipc Land Pattern Name: CAPC200125X85; Octopart: https://octopart.com/cbr08c609cagac-kemet-23841672; Device Class L2: Capacitors; Temperature Range High: +125°C; Voltage Rating: 250 V; RoHS: TRUE; Mouser Description: Multilayer Ceramic Capacitors MLCC - SMD/SMT 250volts 6pF C0G 0805 .25pF Tol RF; Automotive: No
C11 = CMP-2007-03243-2: CAP CER 10UF 10V X5R 0805; Manufacturer Part Number: C0805C106K8PACTU; Manufacturer: Kemet; 3DS Part Number: 220-00001; Tolerance: 10%; Temperature Coefficient: 15%; Material: Ceramic; Device Class L2: Capacitors; Device Class L1: Passive Components; ComponentLink2URL: https://content.kemet.com/datasheets/KEM_C1006_X5R_SMD.pdf; Height: 1.4mm; Lead Free: Yes; Digikey Description: CAP CER 10UF 10V X5R 0805; Octopart: https://octopart.com/c0805c106k8pactu-kemet-98697; Capacitance: 10uF; Value: 10uF; Temperature Range Low: -55°C; Temperature: -55°C to +85°C; Automotive: No; Mouser Description: CAP CER 10UF 10V X5R 0805; Ipc Land Pattern Name: CAPC200125X125; Temperature Range High: +85°C; Voltage: 10V; RoHS: TRUE; Device Class L3: Ceramic Capacitors; ComponentLink2Description: Datasheet; Voltage Rating: 10V; Package: C0805C-DG; Temperature Characteristic: X5R; Category: Cap
D4 D5 = CMP-1426-00007-2: LED GREEN CLEAR 0805 SMD; NexarPartId: 29717780; Manufacturer: Wurth Electronics; Wavelength: 520nm; Forward Current: 100mA; Lens Style: Clear, Rectangular; Dominant Wavelength: 525nm; Max Junction Temperature (Tj): 95°C; Power Dissipation: 105mW; Luminous Intensity: 450mcd; Peak Wavelength: 515nm; Viewing Angle: 140°; Test Current: 20mA; Reverse Voltage: 5V; Forward Voltage: 3.2V; Lens Color: Colorless; Lens Size: 1.25mm; Mount: Surface Mount; REACH SVHC: Unknown; Min Operating Temperature: -40°C; Case Code (Imperial): 0805; Case/Package: 0805; Max Operating Temperature: 85°C; RoHS: Compliant; Length: 2mm; Height: 700µm; Width: 1.25mm; Color: Green; Case Code (Metric): 2012; Packaging: Tape and Reel; Max Reverse Voltage (DC): 5V; Supplier: Digikey; Supplier Part Number: 732-4983-1-ND; Manufacturer Part Number: 150080GS75000; Category: LEDs; Stock: 34895; Pricing: 1=0.19, 50=0.176, 100=0.151, 500=0.131 (USD); Mounting Technology: Surface Mount; Package Quantity: 1; Series: WL-SMCW; Lens Transparency: Clear; RoHS Compliant: Yes; Reach SVHC Compliant: Unknown; ComponentLink1URL: https://datasheet.ciiva.com/29563/150080gs75000-29563008.pdf?src-supplier=Digikey; ComponentLink1Description: https://datasheet.ciiva.com/29563/150080gs75000-29563008.pdf?src-supplier=Digikey; ComponentLink2URL: https://datasheet.ciiva.com/29279/759434-da-01-en-chipled-0805-w-kl-gruen-150080gs75000-29279039.pdf?src-supplier=Conrad; ComponentLink2Description: https://datasheet.ciiva.com/29279/759434-da-01-en-chipled-0805-w-kl-gruen-150080gs75000-29279039.pdf?src-supplier=Conrad
L2 = CMP-1479-00021-3: as L1 on sheet 05-Power_A; Packaging: Cut Tape (CT); Width: 8mm; Current Rating: 5.4A; Max Operating Temperature: 125°C; Tolerance: 30%; Number of Pins: 2; Mount: Surface Mount; Termination: SMD/SMT; Min Operating Temperature: -40°C; Lead Free: Lead Free; Ambient Temperature Range High: 85°C; RMS Current (Irms): 5.4A; RoHS: Compliant; Case/Package: Nonstandard; Height: 4.3mm; Composition: Wirewound; REACH SVHC: Unknown; Ambient Temperature Range Low: -40°C; Height - Seated (Max): 4.5974mm; Max DC Current: 5.4A; Length: 8mm
R21 R24 = CMP-2001-00628-1: RES SMD 330 OHM 1% 1/8W 0805; Manufacturer: Panasonic; Manufacturer Part Number: ERJ-6ENF3300V; Voltage Rating: 150V; Power Rating: 125mW; Temperature Coefficient: 100ppm/°C; ComponentLink1URL: https://datasheet.ciiva.com/11808/0900766b80eb1d8c-11808093.pdf?src-supplier=Rs; ComponentLink1Description: https://datasheet.ciiva.com/11808/0900766b80eb1d8c-11808093.pdf?src-supplier=Rs; ComponentLink2URL: https://datasheet.ciiva.com/29184/452857-da-01-en-widerstand-0805-era-29184079.pdf?src-supplier=Conrad; ComponentLink2Description: https://datasheet.ciiva.com/29184/452857-da-01-en-widerstand-0805-era-29184079.pdf?src-supplier=Conrad; ComponentLink3URL: https://datasheet.ciiva.com/9182/aoa0000ce26-9182968.pdf?src-supplier=Avnet; ComponentLink3Description: https://datasheet.ciiva.com/9182/aoa0000ce26-9182968.pdf?src-supplier=Avnet; ComponentLink4URL: https://datasheet.ciiva.com/48536/era-eng-tds-48536857.pdf?src-supplier=Distrelec; ComponentLink4Description: https://datasheet.ciiva.com/48536/era-eng-tds-48536857.pdf?src-supplier=Distrelec; ComponentLink5URL: https://datasheet.ciiva.com/22759/485442-22759176.pdf?src-supplier=Farnell; ComponentLink5Description: https://datasheet.ciiva.com/22759/485442-22759176.pdf?src-supplier=Farnell; ComponentLink6URL: https://datasheet.ciiva.com/6138/485442-6138589.pdf?src-supplier=Farnell; ComponentLink6Description: https://datasheet.ciiva.com/6138/485442-6138589.pdf?src-supplier=Farnell; ComponentLink7URL: https://datasheet.ciiva.com/43457/485442-43457816.pdf?src-supplier=Farnell; ComponentLink7Description: https://datasheet.ciiva.com/43457/485442-43457816.pdf?src-supplier=Farnell; ComponentLink8URL: https://datasheet.ciiva.com/6138/485442-6138585.pdf?src-supplier=Farnell; ComponentLink8Description: https://datasheet.ciiva.com/6138/485442-6138585.pdf?src-supplier=Farnell; ComponentLink9URL: https://datasheet.ciiva.com/24164/aoa0000ce26-197354-24164407.pdf?src-supplier=Mouser; ComponentLink9Description: https://datasheet.ciiva.com/24164/aoa0000ce26-197354-24164407.pdf?src-supplier=Mouser; ComponentLink10URL: https://datasheet.ciiva.com/22744/1776116-22744153.pdf?src-supplier=Element14; ComponentLink10Description: https://datasheet.ciiva.com/22744/1776116-22744153.pdf?src-supplier=Element14; ComponentLink11URL: https://datasheet.ciiva.com/46436/485442-46436606.pdf?src-supplier=Element14; ComponentLink11Description: https://datasheet.ciiva.com/46436/485442-46436606.pdf?src-supplier=Element14; ComponentLink12URL: https://datasheet.ciiva.com/16777/70068849-16777611.pdf?src-supplier=Allied+Electronics; ComponentLink12Description: https://datasheet.ciiva.com/16777/70068849-16777611.pdf?src-supplier=Allied+Electronics; ComponentLink13URL: https://datasheet.ciiva.com/30237/54aoa0000ce26-30237450.pdf?src-supplier=Onlinecomponents.com; ComponentLink13Description: https://datasheet.ciiva.com/30237/54aoa0000ce26-30237450.pdf?src-supplier=Onlinecomponents.com; Supplier: Digikey; Supplier Part Number: P330CCT-ND; RoHS: Yes; Category: Chip SMD Resistors; Stock: 40201; Pricing: 1=0.11, 10=0.053, 50=0.0344, 100=0.0292, 500=0.02058, 1000=0.01792 (USD); Mounting Technology: Surface Mount; Case/Package: 0805; Pins: 2; Case Code (Imperial): 0805; Case Code (Metric): 2012; Contact Plating: Tin; Min Operating Temperature: -55°C; Max Operating Temperature: 155°C; Packaging: Tape and Reel; Tolerance: 1%; Package Quantity: 1; Resistor Type: Thick Film; Number of Terminations: 2; Termination: SMD/SMT; Max Power Dissipation: 125mW; Series: ERJ; Resistance Tolerance: 1%; Technology: THICK FILM; Construction: Rectangular; Voltage Rating (DC): 150V; Features: Automotive AEC-Q200; Length: 2mm; Width: 1.2mm; Height: 0.6mm; Depth: 1.25mm; Reach SVHC Compliant: No; Military Standard: Not; RoHS Compliant: Yes; ComponentLink14URL: https://datasheet.ciiva.com/11821/0900766b80f80784-11821635.pdf?src-supplier=Rs; ComponentLink14Description: https://datasheet.ciiva.com/11821/0900766b80f80784-11821635.pdf?src-supplier=Rs; ComponentLink15URL: https://datasheet.ciiva.com/24025/aoa0000ce2-24025991.pdf?src-supplier=Mouser; ComponentLink15Description: https://datasheet.ciiva.com/24025/aoa0000ce2-24025991.pdf?src-supplier=Mouser
R22 = CMP-03412-016799-1: RES SMD 453K OHM 0.1% 1/8W 0805; Manufacturer Part Number: RT0805BRD07453KL; Manufacturer: Yageo; Value: 453KΩ; Tolerance: 0.0025; Temperature Coefficient: 25 ppm/°C; Voltage Rating: 150V; Power Rating: 0.125W; Footprint Url: http://www.yageo.com/exep/pages/download/literatures/PYu-R_Mount_10.pdf; Temperature: -55°C to +155°C; Digikey Description: RES SMD 453K OHM 0.1% 1/8W 0805; Composition: Thin Film; ComponentLink2Description: Datasheet; Device Class L3: Chip SMD Resistors; Ipc Land Pattern Name: RESC200125X50; RoHS: TRUE; Category: Res; ComponentLink2URL: http://www.yageo.com/documents/recent/PYu-RT_1-to-0.01_RoHS_L_9.pdf; Octopart: https://octopart.com/rt0805brd07453kl-yageo-1444540; Temperature Range High: +155°C; Device Class L1: Passive Components; Automotive: No; Height: 0.6mm; Lead Free: Yes; Resistance: 453KΩ; Temperature Range Low: -55°C; Package: RT0805; Mouser Description: Thin Film Resistors - SMD 1/8W 453K ohm .1% 25ppm; Device Class L2: Resistors; Series: RT
R23 = CMP-26527-001446-1: 100kΩ ±1% 0.125W 0805 Thick Film Chip Resistor AEC-Q200 compliant; Temperature Coefficient: 100ppm/°C; Working Voltage: 150V; Power Rating: 125mW; Resistor Type: Thick Film; Length: 2mm; Depth: 1.25mm; Technology: THICK FILM; Construction: Rectangular; Packaging: Tape and Reel; Contact Plating: Tin; Series: RMCF; Min Operating Temperature: -55°C; Resistance: 100kR; Features: Automotive AEC-Q200; Mount: Surface Mount; Height: 0.026inch; Case Code (Metric): 2012; Case/Package: 0805; Width: 0.049inch; Number of Terminations: 2; Radiation Hardening: No; Max Operating Temperature: 155°C; Lead Free: Lead Free; Military Standard: Not; Max Power Dissipation: 125mW; Case Code (Imperial): 0805; RoHS Compliant: Yes; Tolerance: 1%
U3 = CMP-0130-00073-1: 1.75Î¼A Micropower Voltage Detector, Push-Pull Output, 4.63V, 3-Pin SOT-23, Extended Temperature, Tape and Reel; PackageReference: SOT-23-TT3; DatasheetVersion: revD, Jun-2005; Code_IPC: SOT23-3; PackageDescription: 3-Lead Plastic Small Outline Transistor (TT) [SOT-23]; PackageVersion: revBB, Aug-2009
U4 = CMP-04918-000387-1: IC REG BUCK ADJ 2A SOT23-5; Output Configuration: Positive; Min Output Voltage: 600mV; Max Output Voltage: 5.5V; Switching Frequency: 1.5MHz; Output Type: Adjustable; Synchronous Rectifier: Yes; Min Input Voltage: 2.5V; Output Current: 2A; Mount: Surface Mount; Min Operating Temperature: -40°C; Max Operating Temperature: 125°C; RoHS Compliant: Yes; Max Input Voltage: 5.5V; Case/Package: SOT-23-5; Packaging: Cut Tape
U5 = CMP-0130-00043-1: 1.75Î¼A Micropower Voltage Detector, Push-Pull Output, 2.93V, 3-Pin SOT-23, Extended Temperature, Tape and Reel; Manufacturer 1: Microchip; Max Supply Voltage: 5.5V; Min Supply Voltage: 1V; Number of Voltages Monitored: 1; Operating Supply Current: 1.75uA; Reset: Active Low; Watchdog Timer: No; Max Reset Threshold Voltage: 2.974V; Min Reset Threshold Voltage: 2.886V; Quiescent Current: 1uA; Output: TOTEM-POLE; Code_IPC: SOT23-3; DatasheetVersion: revD, Jun-2005; PackageVersion: revBB, Aug-2009; PackageDescription: 3-Lead Plastic Small Outline Transistor (TT) [SOT-23]; PackageReference: SOT-23-TT3; Supplier 1: Digi-Key; Supplier Part Number 1: MCP112T-300E/TTCT-ND; Manufacturer Part Number 1: MCP112T-300E/TT; RoHS: Yes; Category: Voltage Supervisors; Stock 1: 3000; Pricing 1: 1=0.47000 (USD); Mount: Surface Mount; Case/Package: SOT-23-3; Number of Pins: 3; Min Operating Temperature: -40°C; Max Operating Temperature: 125°C; Package Quantity: 3000; Packaging: Tape and Reel; Type: Simple Reset/Power-On Reset,Voltage Detector; Threshold Voltage: 2.93V; Overvoltage Threshold: 2.974V; Undervoltage Threshold: 2.886V; Nominal Supply Current: 1uA; Max Supply Current: 1.75uA; Supply Current: 1uA; Length: 3.04mm; Width: 1.4mm; Height: 1.02mm; Radiation Hardening: No; Lead Free: Lead Free; RoHS Compliant: Yes; Reach SVHC Compliant: Yes; ComponentLink1URL: https://datasheet.ciiva.com/1170/21889d-1170325.pdf?src-supplier=Element14; ComponentLink1Description: https://datasheet.ciiva.com/1170/21889d-1170325.pdf?src-supplier=Element14; ComponentLink2URL: https://datasheet.ciiva.com/5696/21889d-5696088.pdf?src-supplier=Farnell; ComponentLink2Description: https://datasheet.ciiva.com/5696/21889d-5696088.pdf?src-supplier=Farnell; ComponentLink3URL: https://datasheet.ciiva.com/9215/21889d-9215429.pdf?src-supplier=Avnet; ComponentLink3Description: https://datasheet.ciiva.com/9215/21889d-9215429.pdf?src-supplier=Avnet; ComponentLink4URL: https://datasheet.ciiva.com/16388/filehandler-aspxddocname-en020167-16388517.pdf?src-supplier=Future+Electronics; ComponentLink4Description: https://datasheet.ciiva.com/16388/filehandler-aspxddocname-en020167-16388517.pdf?src-supplier=Future+Electronics; ComponentLink5URL: https://datasheet.ciiva.com/1971/21889d-1971982.pdf?src-supplier=Digi-Key; ComponentLink5Description: https://datasheet.ciiva.com/1971/21889d-1971982.pdf?src-supplier=Digi-Key; ComponentLink6URL: https://datasheet.ciiva.com/1971/21889d-1971983.pdf?src-supplier=Digi-Key; ComponentLink6Description: https://datasheet.ciiva.com/1971/21889d-1971983.pdf?src-supplier=Digi-Key; ComponentLink7URL: https://datasheet.ciiva.com/1971/21889d-1971981.pdf?src-supplier=Digi-Key; ComponentLink7Description: https://datasheet.ciiva.com/1971/21889d-1971981.pdf?src-supplier=Digi-Key; Supplier: Newark; Supplier Part Number: 56J7353; Manufacturer: Microchip; Manufacturer Part Number: MCP112T-300E/TT; Pricing: 3000=0.479 (USD); Mounting Technology: Surface Mount; Pins: 3

## Sheet 07-EEPROM.SchDoc
size A
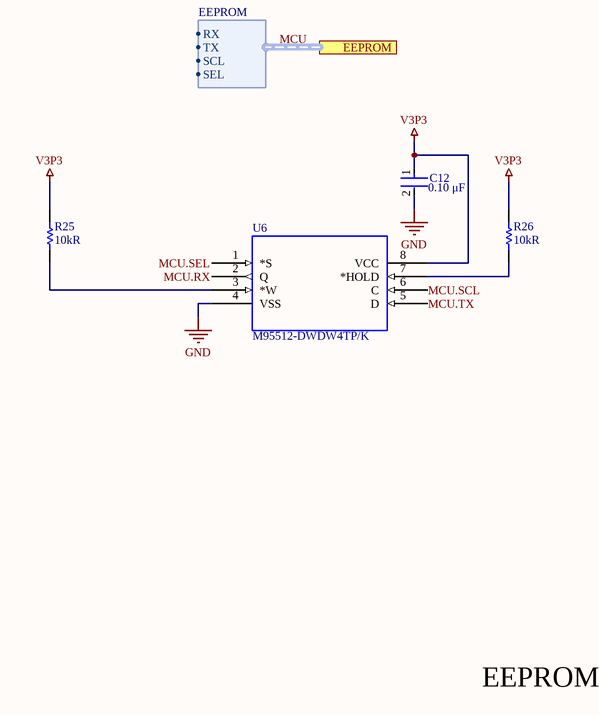
[diagram p6: 07-EEPROM.SchDoc]

### Parts
C12  Capacitance: 0.10 μF  [FP-C0805C-DN-MFG]  (hidden comment: C0805C104K5RACTU)
R25  Resistance: 10kR  [RESC2013X60X35NL10T20]  (hidden comment: RC0805FR-0710KL)
R26  Resistance: 10kR  [RESC2013X60X35NL10T20]  (hidden comment: RC0805FR-0710KL)
U6  M95512-DWDW4TP/K  [TSSOP8_169MILS_DW_STM-M]

### Ports
EEPROM (harness EEPROM)

### Harnesses
EEPROM: RX, TX, SCL, SEL

### Nets
GND: C12.2 U6.4(VSS)
V3P3: C12.1 R25.1 R26.1 U6.8(VCC)
MCU.RX: U6.2(Q)
MCU.SCL: U6.6(C)
MCU.SEL: U6.1(*S)
MCU.TX: U6.5(D)
NetR25_2: R25.2 U6.3(*W)
NetR26_2: R26.2 U6.7(*HOLD)

### Buses and harness runs
harness MCU = port EEPROM

### Notes on the sheet
- EEPROM

### Library data of the parts
C12 = CMP-2007-00279-2: CAP CER 0.1UF 50V X7R 0805; Manufacturer: KEMET; Value: 0.10 μF; Tolerance: 0.1; Temperature Coefficient: 30ppm/°C; Material: Ceramic; Voltage: 500V; Manufacturer Part Number: C0805C104K5RACTU; Device Class L2: Capacitors; Temperature Range Low: -55°C; Voltage Rating: 50 V; Digikey Description: CAP CER 0.1UF 50V X7R 0805; Category: Cap; ComponentLink2Description: Datasheet; Octopart: https://octopart.com/c0805c104k5ractu-kemet-143926; RoHS: TRUE; ComponentLink2URL: https://content.kemet.com/datasheets/KEM_C1003_C0G_SMD.pdf; Temperature Characteristic: X7R; Temperature: -55°C to +125°C; Height: 0.88mm; Temperature Range High: +125°C; Device Class L1: Passive Components; Automotive: No; Lead Free: Yes; Ipc Land Pattern Name: CAPC200125X78; Device Class L3: Ceramic Capacitors; Mouser Description: Cap Ceramic 0.1uF 50V X7R 10% SMD 2.0 x 1.2 mm 125 C Paper T/R; Package: C0805C-DN; Supplier: Digikey; Supplier Part Number: 399-C0805C104K5RAC7800CT-ND; Stock: 2466194; Pricing: 1=0.14, 10=0.091, 50=0.0546, 100=0.043, 500=0.03172, 1000=0.02627 (USD); Mounting Technology: Surface Mount,PCB; Case/Package: 0805; Pins: 2; Case Code (Imperial): 0805; Case Code (Metric): 2012; Min Operating Temperature: -55°C; Max Operating Temperature: 125°C; Dielectric: X7R; Package Quantity: 4000; Packaging: Tape and Reel; Voltage Rating (DC): 50V; Termination: SMD/SMT; Series: SMD Comm X7R; Construction: Flat; Length: 2mm; Width: 1.2mm; Depth: 1.25mm; Lead Pitch: 0.75mm; Radiation Hardening: No; RoHS Compliant: Yes; Reach SVHC Compliant: No; ComponentLink1URL: https://datasheet.ciiva.com/32431/slceramic-chip-condensers-e-32431755.pdf?src-supplier=Distrelec; ComponentLink1Description: https://datasheet.ciiva.com/32431/slceramic-chip-condensers-e-32431755.pdf?src-supplier=Distrelec; ComponentLink3URL: https://datasheet.ciiva.com/28682/1851736-28682232.pdf?src-supplier=Element14; ComponentLink3Description: https://datasheet.ciiva.com/28682/1851736-28682232.pdf?src-supplier=Element14; ComponentLink4URL: https://datasheet.ciiva.com/18410/70095383-18410815.pdf?src-supplier=Allied+Electronics; ComponentLink4Description: https://datasheet.ciiva.com/18410/70095383-18410815.pdf?src-supplier=Allied+Electronics; ComponentLink5URL: https://datasheet.ciiva.com/14589/70095383-14589048.pdf?src-supplier=Allied+Electronics; ComponentLink5Description: https://datasheet.ciiva.com/14589/70095383-14589048.pdf?src-supplier=Allied+Electronics
R25 R26 = CMP-1659-00013-4: Chip Resistor, 10 KOhm, +/- 1%, 0.125 W, -55 to 155 degC, 0805 (2012 Metric), RoHS, Tape and Reel; Manufacturer: Yageo; Voltage Rating: 150 V; Power Rating: 125mW; Temperature Coefficient: 100ppm/°C; Mount: Surface Mount; ComponentLink1Description: Manufacturer URL; ComponentLink2URL: http://www.yageo.com/documents/recent/PYu-RC_Group_51_RoHS_L_04.pdf; Pins: 2; Length: 2 mm; Min Operating Temperature: -55 degC; Height: 0.5 mm; Mounting Technology: Surface Mount; RoHSCompliant: true; REACH SVHC: No SVHC; ComponentLink1URL: http://www.yageo.com/; Max Operating Temperature: 155 degC; PackageReference: 0805; DatasheetVersion: Rev. 4, 02/2016; Package Quantity: 5000; Packaging: Tape and Reel; ComponentLink2Description: Datasheet; PackageDescription: 2-Pin Surface Mounted Device, Body 2 x 1.25 mm; Supplier 1: Digi-Key; Supplier Part Number 1: 311-10.0KCRCT-ND; Manufacturer 1: Yageo; Manufacturer Part Number 1: RC0805FR-0710KL; RoHS: Yes; Category: Chip SMD Resistors; Stock 1: 12202331; Pricing 1: 1=0.10000, 10=0.03700, 100=0.01520, 1000=0.00682, 2500=0.00592 (USD); Case/Package: 0805; Case Code (Imperial): 0805; Case Code (Metric): 2012; Size Code: 0805; Tolerance: 1%; Termination: SMD/SMT; Series: RC; Max Power Dissipation: 125mW; Resistance Tolerance: 1%; Resistor Type: Thick Film; Number of Terminations: 2; Features: Moisture Resistant; Construction: Rectangular; Technology: THICK FILM; Width: 0.049inch; Depth: 1.25mm; RoHS Compliant: Yes; Lead Free: Lead Free; Military Standard: Not
U6 = M95512-DWDW4TP/K: EEPROM Serial-SPI 512K-bit 64K x 8 3.3V/5V Automotive 8-Pin TSSOP T/R; Mfr_Name: STMicroelectronics; Interface: SPI,Serial; Density: 512Kb; Frequency: 10MHz; Min Supply Voltage: 2.5V; Max Supply Voltage: 5.5V; Access Time: 25ns; Max Frequency: 16MHz; Nominal Supply Current: 4mA; ComponentLink1URL: https://datasheet.ciiva.com/29614/dm00046608-29614432.pdf?src-supplier=Digi-Key; ComponentLink1Description: https://datasheet.ciiva.com/29614/dm00046608-29614432.pdf?src-supplier=Digi-Key; ComponentLink2URL: https://datasheet.ciiva.com/48501/dm00046608-48501612.pdf?src-supplier=Avnet; ComponentLink2Description: https://datasheet.ciiva.com/48501/dm00046608-48501612.pdf?src-supplier=Avnet; RoHS: Yes; Category: EEPROM; Case/Package: TSSOP; Min Operating Temperature: -40°C; Max Operating Temperature: 145°C; Packaging: Tape and Reel; Radiation Hardening: No; RoHS Compliant: Yes; Copyright: Copyright (C) 2022 Ultra Librarian. All rights reserved.; Manufacturer_Part_Number: M95512-DWDW4TP/K; RefDes: RefDes; Type: DEV; Supplier 1: Digi-Key; Supplier Part Number 1: 497-14459-1-ND; Manufacturer 1: STMicroelectronics; Manufacturer Part Number 1: M95512-DWDW4TP/K; Stock 1: 11469; Pricing 1: 1=2.30000, 10=2.07100, 25=2.03920, 50=2.03400, 100=1.81740, 250=1.76084 (USD); Mount: Surface Mount; Number of Pins: 8; Memory Type: EEPROM

## Sheet Potentiometer.SchDoc: Buzzer
size A; Date: 4/25/2017; ApprovedBy: JSK; CheckedBy: JSK; Author: JSK; CompanyName: University of Wisconsin; DrawnBy: JSK; Engineer: JSK; Organization: ECE 315; Address1: College of Engineering; Address2: 1415 Engineering Drive; Address3: Madison, WI 53706; Address4: ECE 315 Fall 2017; Revision: A; SheetNumber: 5; SheetTotal: 6; AssemblyNumber: ECE315-F19; ApprovedDate: 04/02/2019; ECE_Project_name: ECE315 S25
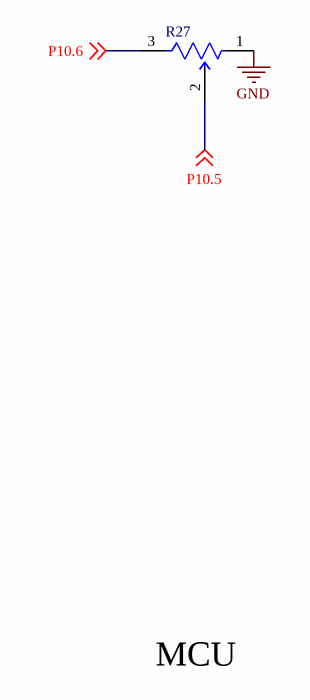
[diagram p7: Potentiometer.SchDoc]

### Parts
(Parts that share a designator on the sheet are numbered #1, #2 ... from top to bottom, then left to right.)
R27#1  3386P-1-103LF  [FP-3386P-MFG]  (value not drawn)

### Nets
GND: R27#1.1(CCW)
P10.5: R27#1.2(WIPER) ; off-sheet P10.5
P10.6: R27#1.3(CW) ; off-sheet P10.6

### Notes on the sheet
- MCU
- Title:
- Size:
- A
- Project
- Rev:
- Sheet:
- of
- College of Engineering
- 1415 Engineering Drive
- Madison, WI 53706

### Library data of the parts
R27#1 = CMP-2000-05592-8: TRIMMER 10K OHM 0.5W PC PIN TOP; Manufacturer Series: 3386; Resistance Law: Linear; Voltage Rating: 300V; Actuator Orientation: Vertical; Tolerance: 10%; Number of Turns: 1; Resistance: 100kR; Number of Terminals/Pins: 3; Temperature Coefficient: 100ppm/°C; Max Power Dissipation: 500mW; Actuator Type: SCREW; Radiation Hardening: No; Package Quantity: 100; Type: Potentiometer; Contact Plating: Tin; RoHS Compliant: Yes; Depth: 9.53mm; Terminal Finish: Tin; Taper: Linear; Color: Blue; Number of Pins: 3; Width: 9.53mm; Lead Free: Contains Lead; Reach SVHC Compliant: Yes; Packaging: Rail/Tube; Min Operating Temperature: -55°C; Max Operating Temperature: 125°C; Technology: CERMET; Height: 4.83mm; Series: Trimpot® 3386 - Sealed; Termination: Pin; Resistance Tolerance: 10%; Power Rating: 500mW; Resistor Type: Cermet; Mount: Through Hole; Military Standard: Not; Length: 9.53mm; Weight: 0.03oz

## Sheet 08-Potentiometer.SchDoc
size A
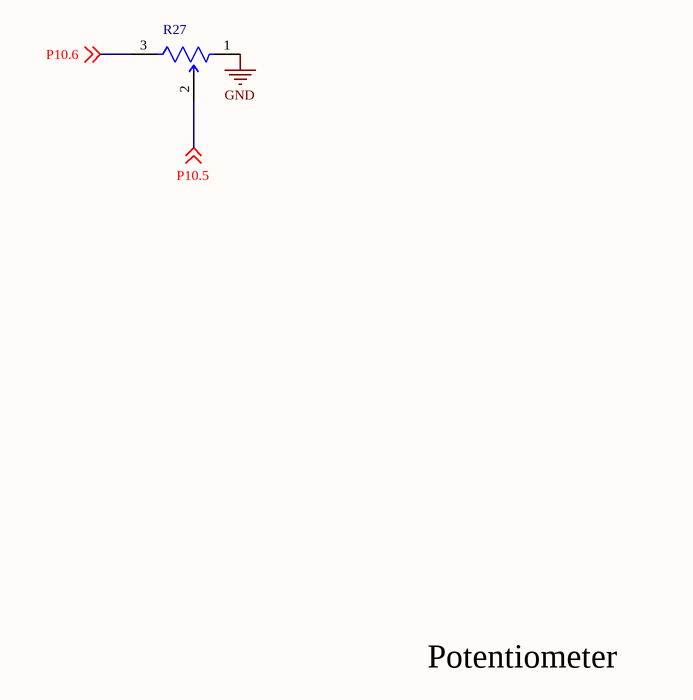
[diagram p8: 08-Potentiometer.SchDoc]

### Parts
(Parts that share a designator on the sheet are numbered #1, #2 ... from top to bottom, then left to right.)
R27#2  3386P-1-103LF  [FP-3386P-MFG]  (value not drawn)

### Nets
GND: R27#2.1(CCW)
P10.5: R27#2.2(WIPER) ; off-sheet P10.5
P10.6: R27#2.3(CW) ; off-sheet P10.6

### Notes on the sheet
- Potentiometer

### Library data of the parts
R27#2 = CMP-2000-05592-8: as R27#1 on sheet Potentiometer; Radiation Hardening: No; Package Quantity: 100; Type: Potentiometer; Contact Plating: Tin; RoHS Compliant: Yes; Depth: 9.53mm; Terminal Finish: Tin; Taper: Linear; Color: Blue; Number of Pins: 3; Width: 9.53mm; Lead Free: Contains Lead; Reach SVHC Compliant: Yes; Packaging: Rail/Tube; Min Operating Temperature: -55°C; Max Operating Temperature: 125°C; Technology: CERMET; Height: 4.83mm; Series: Trimpot® 3386 - Sealed; Termination: Pin; Resistance Tolerance: 10%; Power Rating: 500mW; Resistor Type: Cermet; Mount: Through Hole; Military Standard: Not; Length: 9.53mm; Weight: 0.03oz

## Nets that join several sheets
GND: 02-MCU (6 pins), 03-Headers (6 pins), 04-USB (J4.A12 J4.B12 R2.2 R3.2), 05-Power_A (22 pins), 06-Power_B (8 pins), 07-EEPROM (C12.2 U6.4), Potentiometer (R27#1.1), 08-Potentiometer (R27#2.1)
V3P3: 02-MCU (U1.J2.20), 03-Headers (5 pins), 06-Power_B (5 pins), 07-EEPROM (C12.1 R25.1 R26.1 U6.8)
V5P0: 03-Headers (C13.1 C14.1 C15.1 J3.1), 05-Power_A (TP2.1), 06-Power_B (C9.1 U3.3 U4.1 U4.4)
VUSB: 04-USB (J4.A9 J4.B9), 05-Power_A (C1.1 R8.2 R9.2 U2.20)
P10.5: 02-MCU (U1.J2.5), Potentiometer (R27#1.2), 08-Potentiometer (R27#2.2)
P10.6: 02-MCU (U1.J2.4), Potentiometer (R27#1.3), 08-Potentiometer (R27#2.3)